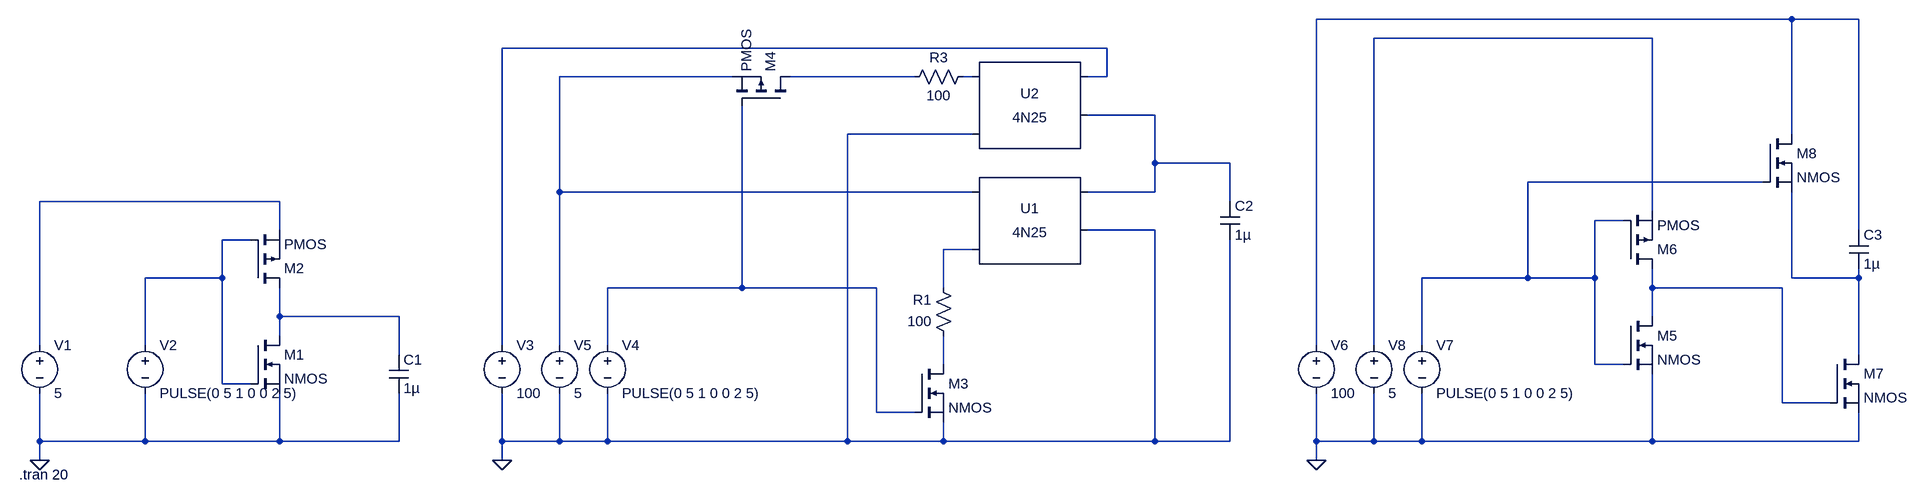
[diagram p0: schematic igbt_gate_driver.asc]
igbt_gate_driver.asc, the LTspice schematic file:
Version 4
SHEET 1 3352 680
WIRE 3152 -416 2208 -416
WIRE 3264 -416 3152 -416
WIRE 2768 -384 2304 -384
WIRE 1840 -368 832 -368
WIRE 1216 -320 928 -320
WIRE 1520 -320 1312 -320
WIRE 1616 -320 1600 -320
WIRE 1840 -320 1840 -368
WIRE 1840 -320 1808 -320
WIRE 1920 -256 1808 -256
WIRE 1616 -224 1408 -224
WIRE 3152 -224 3152 -416
WIRE 1920 -176 1920 -256
WIRE 2064 -176 1920 -176
WIRE 3104 -144 2560 -144
WIRE 928 -128 928 -320
WIRE 1616 -128 928 -128
WIRE 1920 -128 1920 -176
WIRE 1920 -128 1808 -128
WIRE 416 -112 16 -112
WIRE 2064 -112 2064 -176
WIRE 2768 -96 2768 -384
WIRE 2720 -80 2672 -80
WIRE 416 -64 416 -112
WIRE 1920 -64 1808 -64
WIRE 3264 -64 3264 -416
WIRE 368 -48 320 -48
WIRE 1616 -32 1568 -32
WIRE 320 16 320 -48
WIRE 320 16 192 16
WIRE 2560 16 2560 -144
WIRE 2560 16 2384 16
WIRE 2672 16 2672 -80
WIRE 2672 16 2560 16
WIRE 3152 16 3152 -128
WIRE 3264 16 3264 0
WIRE 3264 16 3152 16
WIRE 1232 32 1232 -272
WIRE 1232 32 1008 32
WIRE 1456 32 1232 32
WIRE 1568 32 1568 -32
WIRE 2768 32 2768 0
WIRE 3136 32 2768 32
WIRE 416 80 416 32
WIRE 640 80 416 80
WIRE 2768 80 2768 32
WIRE 416 112 416 80
WIRE 16 128 16 -112
WIRE 192 128 192 16
WIRE 832 128 832 -368
WIRE 928 128 928 -128
WIRE 1008 128 1008 32
WIRE 2208 128 2208 -416
WIRE 2304 128 2304 -384
WIRE 2384 128 2384 16
WIRE 640 144 640 80
WIRE 3264 144 3264 16
WIRE 1568 160 1568 112
WIRE 2672 160 2672 16
WIRE 2720 160 2672 160
WIRE 320 192 320 16
WIRE 368 192 320 192
WIRE 3136 224 3136 32
WIRE 3216 224 3136 224
WIRE 1456 240 1456 32
WIRE 1520 240 1456 240
WIRE 16 288 16 208
WIRE 192 288 192 208
WIRE 192 288 16 288
WIRE 416 288 416 208
WIRE 416 288 192 288
WIRE 640 288 640 208
WIRE 640 288 416 288
WIRE 832 288 832 208
WIRE 928 288 928 208
WIRE 928 288 832 288
WIRE 1008 288 1008 208
WIRE 1008 288 928 288
WIRE 1408 288 1408 -224
WIRE 1408 288 1008 288
WIRE 1568 288 1568 256
WIRE 1568 288 1408 288
WIRE 1920 288 1920 -64
WIRE 1920 288 1568 288
WIRE 2064 288 2064 -48
WIRE 2064 288 1920 288
WIRE 2208 288 2208 208
WIRE 2304 288 2304 208
WIRE 2304 288 2208 288
WIRE 2384 288 2384 208
WIRE 2384 288 2304 288
WIRE 2768 288 2768 176
WIRE 2768 288 2384 288
WIRE 3264 288 3264 240
WIRE 3264 288 2768 288
WIRE 16 320 16 288
WIRE 832 320 832 288
WIRE 2208 320 2208 288
FLAG 16 320 0
FLAG 832 320 0
FLAG 2208 320 0
SYMBOL voltage 16 112 R0
WINDOW 123 0 0 Left 0
WINDOW 39 0 0 Left 0
SYMATTR InstName V1
SYMATTR Value 5
SYMBOL voltage 192 112 R0
WINDOW 123 0 0 Left 0
WINDOW 39 0 0 Left 0
SYMATTR InstName V2
SYMATTR Value PULSE(0 5 1 0 0 2 5)
SYMBOL nmos 368 112 R0
SYMATTR InstName M1
SYMBOL pmos 368 32 M180
SYMATTR InstName M2
SYMBOL cap 624 144 R0
SYMATTR InstName C1
SYMATTR Value 1µ
SYMATTR SpiceLine Rser=1m
SYMBOL voltage 832 112 R0
WINDOW 123 0 0 Left 0
WINDOW 39 0 0 Left 0
SYMATTR InstName V3
SYMATTR Value 100
SYMBOL voltage 1008 112 R0
WINDOW 123 0 0 Left 0
WINDOW 39 0 0 Left 0
SYMATTR InstName V4
SYMATTR Value PULSE(0 5 1 0 0 2 5)
SYMBOL cap 2048 -112 R0
SYMATTR InstName C2
SYMATTR Value 1µ
SYMATTR SpiceLine Rser=1m
SYMBOL Optos\\4N25 1712 -64 R0
SYMATTR InstName U1
SYMBOL Optos\\4N25 1712 -256 R0
SYMATTR InstName U2
SYMBOL voltage 928 112 R0
WINDOW 123 0 0 Left 0
WINDOW 39 0 0 Left 0
SYMATTR InstName V5
SYMATTR Value 5
SYMBOL res 1584 128 R180
WINDOW 0 36 76 Left 2
WINDOW 3 36 40 Left 2
SYMATTR InstName R1
SYMATTR Value 100
SYMBOL res 1616 -336 R90
WINDOW 0 0 56 VBottom 2
WINDOW 3 32 56 VTop 2
SYMATTR InstName R3
SYMATTR Value 100
SYMBOL pmos 1312 -272 M270
SYMATTR InstName M4
SYMBOL nmos 1520 160 R0
SYMATTR InstName M3
SYMBOL voltage 2208 112 R0
WINDOW 123 0 0 Left 0
WINDOW 39 0 0 Left 0
SYMATTR InstName V6
SYMATTR Value 100
SYMBOL voltage 2384 112 R0
WINDOW 123 0 0 Left 0
WINDOW 39 0 0 Left 0
SYMATTR InstName V7
SYMATTR Value PULSE(0 5 1 0 0 2 5)
SYMBOL cap 3248 -64 R0
SYMATTR InstName C3
SYMATTR Value 1µ
SYMATTR SpiceLine Rser=1m
SYMBOL nmos 2720 80 R0
SYMATTR InstName M5
SYMBOL pmos 2720 0 M180
SYMATTR InstName M6
SYMBOL voltage 2304 112 R0
WINDOW 123 0 0 Left 0
WINDOW 39 0 0 Left 0
SYMATTR InstName V8
SYMATTR Value 5
SYMBOL nmos 3216 144 R0
SYMATTR InstName M7
SYMBOL nmos 3104 -224 R0
SYMATTR InstName M8
TEXT -18 344 Left 2 !.tran 20

The netlist it stands for:
* igbt_gate_driver.asc
V1 N009 0 5
V2 N010 0 PULSE(0 5 1 0 0 2 5)
M1 N015 N010 0 0 NMOS
M2 N015 N010 N009 N009 PMOS
C1 N015 0 1µ Rser=1m
V3 N003 0 100
V4 N013 0 PULSE(0 5 1 0 0 2 5)
C2 N007 0 1µ Rser=1m
XU1 N004 N011 N007 0 NC_01 4N25
XU2 N006 0 N003 N007 NC_02 4N25
V5 N004 0 5
R1 N016 N011 100
R3 N006 N005 100
M4 N005 N013 N004 N004 PMOS
M3 N016 N013 0 0 NMOS
V6 N001 0 100
V7 N008 0 PULSE(0 5 1 0 0 2 5)
C3 N001 N012 1µ Rser=1m
M5 N014 N008 0 0 NMOS
M6 N014 N008 N002 N002 PMOS
V8 N002 0 5
M7 N012 N014 0 0 NMOS
M8 N001 N008 N012 N012 NMOS
.model NMOS NMOS
.model PMOS PMOS
.lib standard.mos
.tran 20
.lib 4N25.sub
.backanno
.end